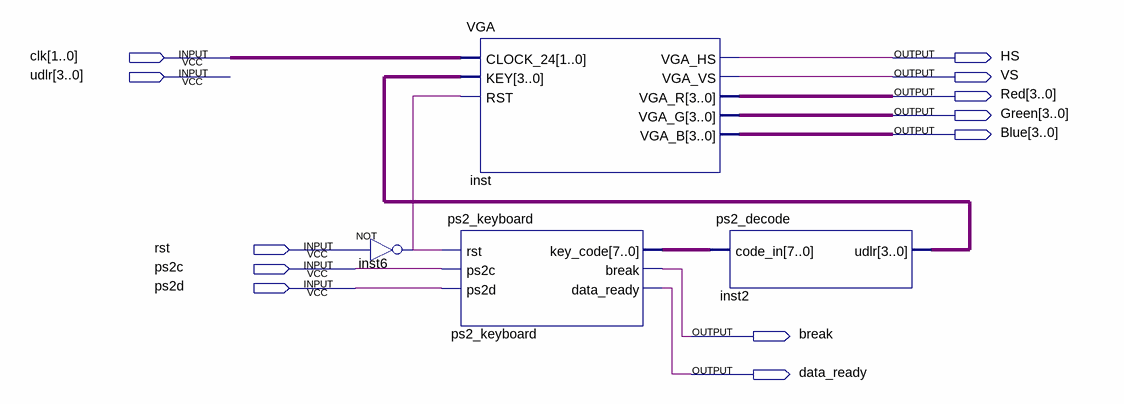
[diagram p0: schematic sheet]
// Quartus schematic top.bdf as structural Verilog: 4 symbols, 12 pins
module top (
  input  [1:0] clk,
  input  [3:0] udlr,
  input  rst,
  input  ps2c,
  input  ps2d,
  output HS,
  output VS,
  output [3:0] Red,
  output [3:0] Green,
  output [3:0] Blue,
  output \break ,
  output data_ready
);

  wire inst6_out;
  wire [3:0] inst2_udlr;
  wire [7:0] ps2_keyboard_key_code;

  not inst6 (inst6_out, rst);
  VGA inst (
    .CLOCK_24(clk), .KEY(inst2_udlr), .RST(inst6_out), .VGA_HS(HS), .VGA_VS(VS), .VGA_R(Red), .VGA_G(Green),
    .VGA_B(Blue));
  ps2_keyboard ps2_keyboard (
    .rst(inst6_out), .ps2c(ps2c), .ps2d(ps2d), .key_code(ps2_keyboard_key_code), .\break (\break ),
    .data_ready(data_ready));
  ps2_decode inst2 (.code_in(ps2_keyboard_key_code), .udlr(inst2_udlr));
endmodule
